# Altium schematic sheet Current.SchDoc
size 420 x 297 mm; SheetNumber: 2; SheetTotal: 5
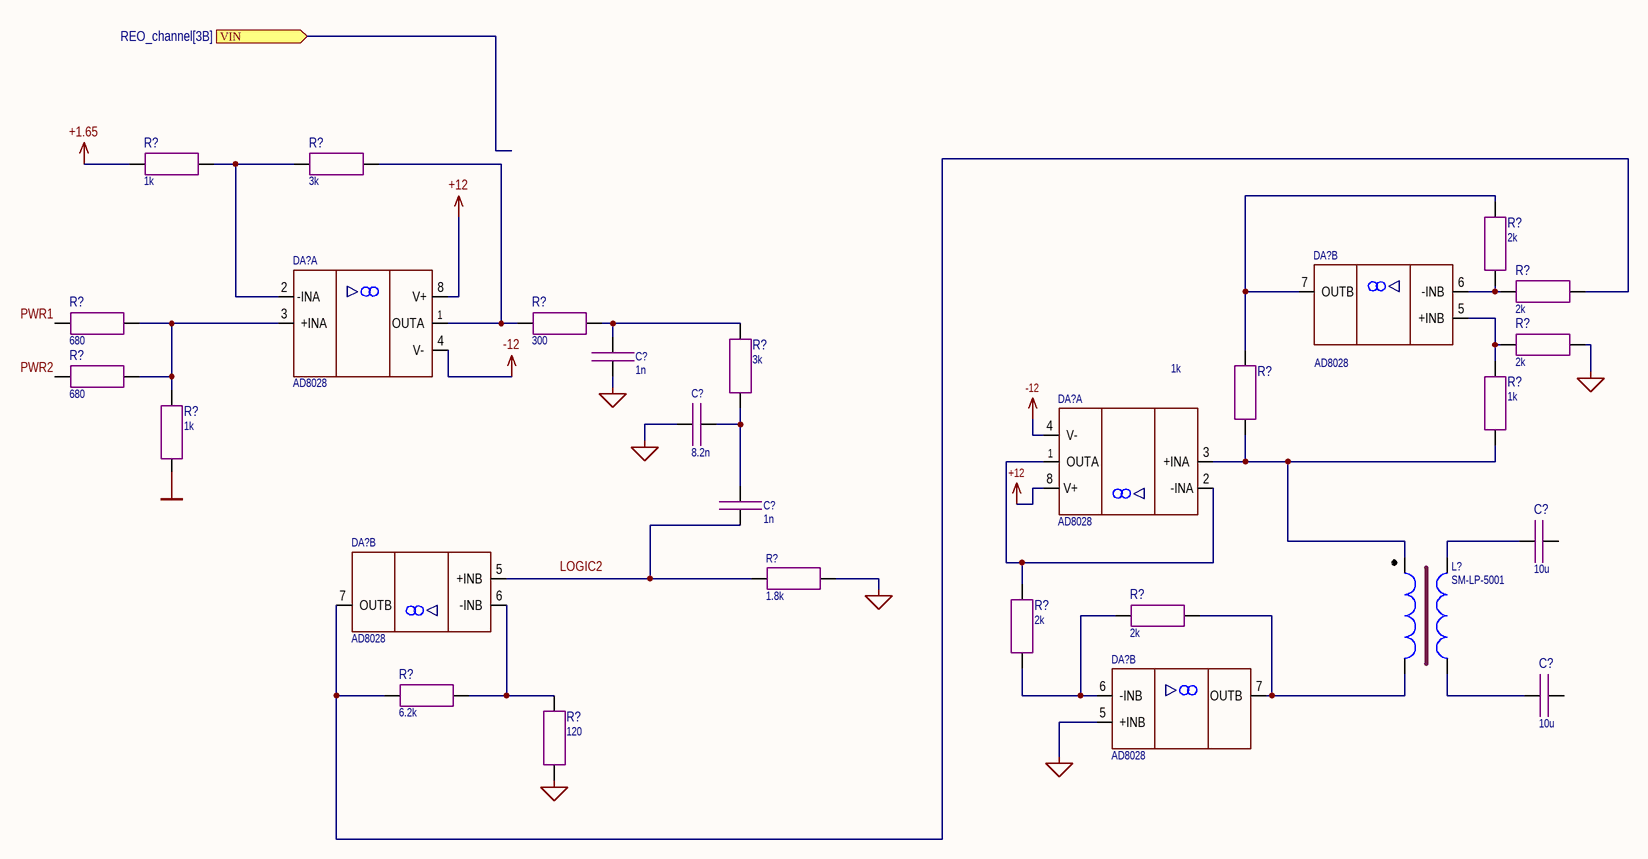
[diagram p0: Current.SchDoc]

## Parts
(Parts that share a designator on the sheet are numbered #1, #2 ... from top to bottom, then left to right.)
C?#1  1n
C?#2  8.2n
C?#3  1n
C?#4  10u  [CAP: SMD 0805 MD IPC 782]
C?#5  10u  [CAP: SMD 0805 MD IPC 782]
DA?#1  AD8028  [IC: SOIC 8]  (part B of 2)
DA?#2  AD8028  [IC: SOIC 8]  (part A of 2)
DA?#3  AD8028  [IC: SOIC 8]  (part A of 2)
DA?#4  AD8028  [IC: SOIC 8]  (part B of 2)
DA?#5  AD8028  [IC: SOIC 8]  (part B of 2)
L?  SM-LP-5001  [IND: SM-LP-5001E]
R?#1  1k  [RES: SMD 0603 MD IPC 782]
R?#2  3k  [RES: SMD 0603 MD IPC 782]
R?#3  2k  [RES: SMD 0805 MD IPC 782]
R?#4  2k  [RES: SMD 0805 MD IPC 782]
R?#5  680  [RES: SMD 0603 MD IPC 782]
R?#6  300  [RES: SMD 0603 MD IPC 782]
R?#7  2k  [RES: SMD 0805 MD IPC 782]
R?#8  1k  [RES: SMD 0805 MD IPC 782]
R?#9  680  [RES: SMD 0603 MD IPC 782]
R?#10  3k  [RES: SMD 0603 MD IPC 782]
R?#11  1k  [RES: SMD 0805 MD IPC 782]
R?#12  1k  [RES: SMD 0603 MD IPC 782]
R?#13  1.8k
R?#14  2k  [RES: SMD 0805 MD IPC 782]
R?#15  2k  [RES: SMD 0805 MD IPC 782]
R?#16  6.2k  [RES: SMD 0603 MD IPC 782]
R?#17  120  [RES: SMD 0805 MD IPC 782]

## Ports
VIN (in, see REO_channel[3B])

## Nets
+1.65: R?#1.1
+12: DA?#2.8(V+) DA?#3.8(V+)
-12: DA?#2.4(V-) DA?#3.4(V-)
NetC?#1_1: C?#1.1 C?#2.2 DA?#5.5(+INB) R?#7.2 R?#13.2 R?#17.1
NetC?#1_2: C?#1.2 R?#6.2 R?#10.2
NetC?#2_1: C?#2.1 C?#3.2 R?#10.1
NetC?#3_1: C?#3.1 DA?#4.5(+INB) R?#13.1
NetC?#4_2: C?#4.2 L?.4
NetC?#5_2: C?#5.2 L?.6
NetDA?#1_5: DA?#1.5(+INB) R?#7.1 R?#11.2
NetDA?#1_6: DA?#1.6(-INB) R?#3.2 R?#4.1
NetDA?#1_7: DA?#1.7(OUTB) R?#3.1 R?#8.1
NetDA?#2_1: DA?#2.1(OUTA) R?#2.2 R?#6.1
NetDA?#2_2: DA?#2.2(-INA) R?#1.2 R?#2.1
NetDA?#2_3: DA?#2.3(+INA) R?#5.2 R?#9.2 R?#12.2
NetDA?#3_1: DA?#3.1(OUTA) DA?#3.2(-INA) R?#14.1
NetDA?#3_3: DA?#3.3(+INA) L?.1 R?#8.2 R?#11.1
NetDA?#4_6: DA?#4.6(-INB) R?#16.2 R?#17.2
NetDA?#4_7: DA?#4.7(OUTB) R?#4.2 R?#16.1
NetDA?#5_6: DA?#5.6(-INB) R?#14.2 R?#15.1
NetDA?#5_7: DA?#5.7(OUTB) L?.3 R?#15.2

Not connected (* = marked no-connect by the designer): C?#4 1; C?#5 1; R?#5 1; R?#9 1; R?#12 1

## Notes on the sheet
- Labels drawn without touching a wire or pin: GNDD, LOGIC2, PWR1, PWR2
- Подп. и дата
- Инв. № дубл.
- Взам. инв. №
- Инв. № подл.
- Изм.
- Лист
- № докум.
- Подп.
- Дата
- 2.106-A3
- Копировал
- Формат А3

## Library data of the parts
C?#1 C?#3 = 1n 50V 0603 ±5%
C?#2 = 8.2n 50V 0805 5%
C?#4 C?#5 = 10u 50V 0805 ±10%: Code: 6289735441; Name: Конденсатор 12065D106KAT2A, AVX
DA?#1-DA?#5 = AD8028_part
R?#1 R?#12 = 1k ±1% 0603: Code: 6069174188; Name: Резистор 1k ±1% 0603
R?#2 R?#10 = 3k ±1% 0603: Code: 6094357331; Name: Резистор 3К ±1% 0603
R?#3 R?#4 R?#7 R?#14 R?#15 = 2k ±1% 0805: Code: 6094352561; Name: Резистор 2k±1%  0805
R?#5 R?#9 = 680 ±1% 0603: Code: 6069180761; Name: Резистор 680R ±1% 0603
R?#6 = 300 ±1% 0603: Code: 6069180661; Name: Резистор 300R±1% 0603
R?#8 R?#11 = 1k ±1% 0805: Code: 6027158691; Name: Резистор RC0805FR-071KL, Yageo
R?#13 = 1.8k ±1% 0603
R?#16 = 3.3k ±5% 0603
R?#17 = 51 ±1% 0805: Code: 6094354057; Name: Резистор 51K±1% 0805